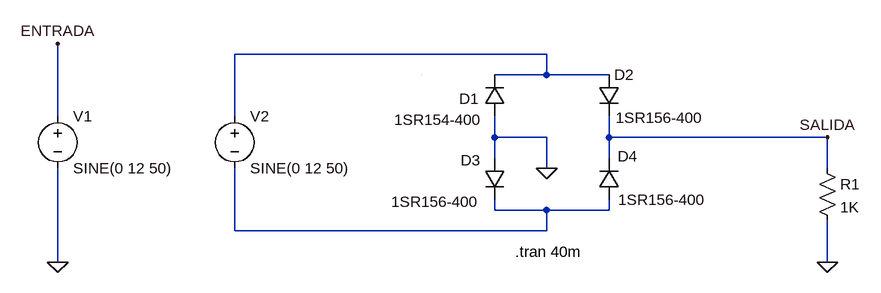
[diagram p0: schematic puente-rectificador.asc]
puente-rectificador.asc, the LTspice schematic file:
Version 4
SHEET 1 880 680
WIRE 192 -32 -288 -32
WIRE 192 0 192 -32
WIRE 192 0 112 0
WIRE 288 0 192 0
WIRE -560 64 -560 -48
WIRE -288 64 -288 -32
WIRE 112 96 112 64
WIRE 192 96 112 96
WIRE 288 96 288 64
WIRE 624 96 288 96
WIRE 112 128 112 96
WIRE 288 128 288 96
WIRE 192 144 192 96
WIRE 624 144 624 96
WIRE 112 208 112 192
WIRE 192 208 112 208
WIRE 288 208 288 192
WIRE 288 208 192 208
WIRE -288 240 -288 144
WIRE 192 240 192 208
WIRE 192 240 -288 240
WIRE -560 288 -560 144
WIRE 624 288 624 224
WIRE 0 0 0 0
FLAG 624 288 0
FLAG 624 96 SALIDA
FLAG 192 144 0
FLAG -560 288 0
FLAG -560 -48 ENTRADA
SYMBOL diode 96 128 R0
WINDOW 0 -36 3 Left 2
WINDOW 3 206 64 Left 2
SYMATTR InstName D3
SYMATTR Value 1SR156-400
SYMBOL voltage -288 48 R0
WINDOW 123 0 0 Left 0
WINDOW 39 0 0 Left 0
SYMATTR InstName V2
SYMATTR Value SINE(0 12 50)
SYMBOL res 608 128 R0
SYMATTR InstName R1
SYMATTR Value 1K
SYMBOL diode 128 64 R180
WINDOW 0 40 27 Left 2
WINDOW 3 35 -5 Left 2
SYMATTR InstName D1
SYMATTR Value 1SR154-400
SYMBOL diode 272 0 R0
WINDOW 3 26 66 Left 2
SYMATTR Value 1SR156-400
SYMATTR InstName D2
SYMBOL diode 304 192 R180
WINDOW 0 -28 67 Left 2
WINDOW 3 215 -3 Left 2
SYMATTR InstName D4
SYMATTR Value 1SR156-400
SYMBOL voltage -560 48 R0
WINDOW 123 0 0 Left 0
WINDOW 39 0 0 Left 0
SYMATTR InstName V1
SYMATTR Value SINE(0 12 50)
TEXT 144 272 Left 2 !.tran 40m

The netlist it stands for:
* puente-rectificador.asc
D3 0 N002 1SR156-400
V2 N001 N002 SINE(0 12 50)
R1 SALIDA 0 1K
D1 0 N001 1SR154-400
D2 N001 SALIDA 1SR156-400
D4 N002 SALIDA 1SR156-400
V1 ENTRADA 0 SINE(0 12 50)
.model D D
.lib standard.dio
.tran 40m
.backanno
.end